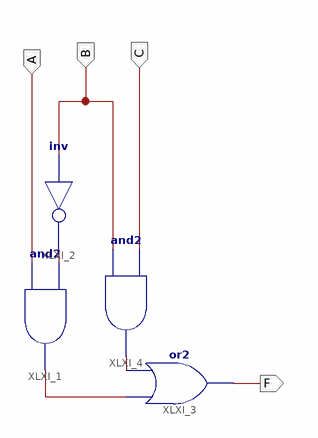
[diagram p0: schematic sheet 1]
// Xilinx ISE schematic simple_logic.sch (artix7) as structural Verilog: 4 symbols, 4 ports
module simple_logic (
  input  C,
  input  A,
  input  B,
  output F
);

  wire XLXN_2, XLXN_5, XLXN_20;

  and XLXI_1 (XLXN_2, A, XLXN_20);
  not XLXI_2 (XLXN_20, B);
  or XLXI_3 (F, XLXN_2, XLXN_5);
  and XLXI_4 (XLXN_5, B, C);
endmodule
